# EAGLE design BUS2BUS_1 (EAGLE 6.5.0)
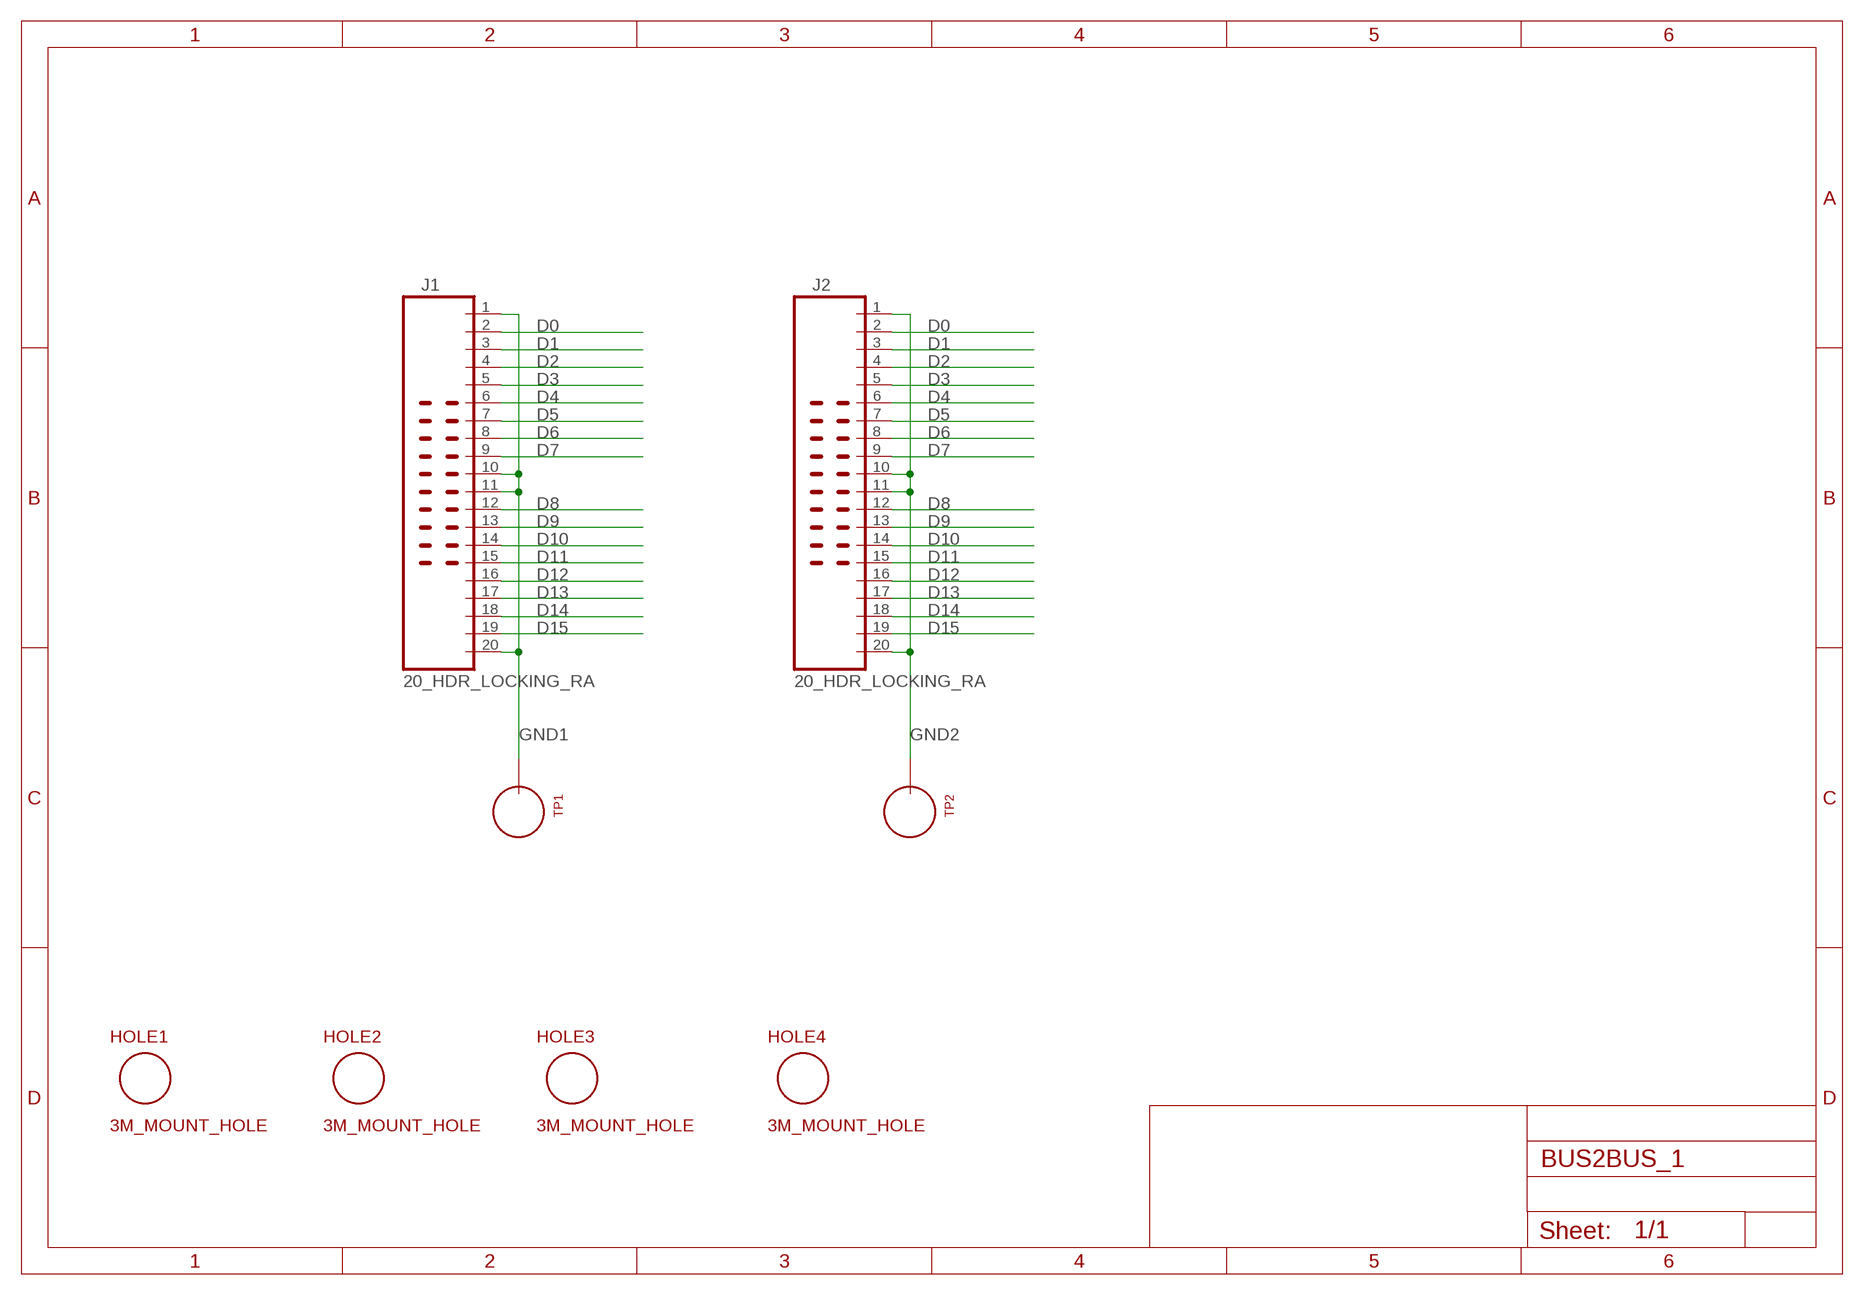
[diagram p0: schematic, sheet 1]

## Parts
HOLE1  3M_MOUNT_HOLE  [3M_HOLE]
HOLE2  3M_MOUNT_HOLE  [3M_HOLE]
HOLE3  3M_MOUNT_HOLE  [3M_HOLE]
HOLE4  3M_MOUNT_HOLE  [3M_HOLE]
J1  20_HDR_LOCKING_RA  [20_HDR_LOCKING_RA]
J2  20_HDR_LOCKING_RA  [20_HDR_LOCKING_RA]
TP1  TEST_LOOP  [TEST_LOOP]
TP2  TEST_LOOP  [TEST_LOOP]

## Nets
D0: J1.2 J2.2
D1: J1.3 J2.3
D2: J1.4 J2.4
D3: J1.5 J2.5
D4: J1.6 J2.6
D5: J1.7 J2.7
D6: J1.8 J2.8
D7: J1.9 J2.9
D8: J1.12 J2.12
D9: J1.13 J2.13
D10: J1.14 J2.14
D11: J1.15 J2.15
D12: J1.16 J2.16
D13: J1.17 J2.17
D14: J1.18 J2.18
D15: J1.19 J2.19
GND1: J1.1 J1.10 J1.11 J1.20 TP1.P$1
GND2: J2.1 J2.10 J2.11 J2.20 TP2.P$1

## Library data of the parts
HOLE1-HOLE4 = MyLib:3M_MOUNT_HOLE
J1 J2 = MyLib:20_HDR_LOCKING_RA
TP1 TP2 = MyLib:TEST_LOOP

## Board
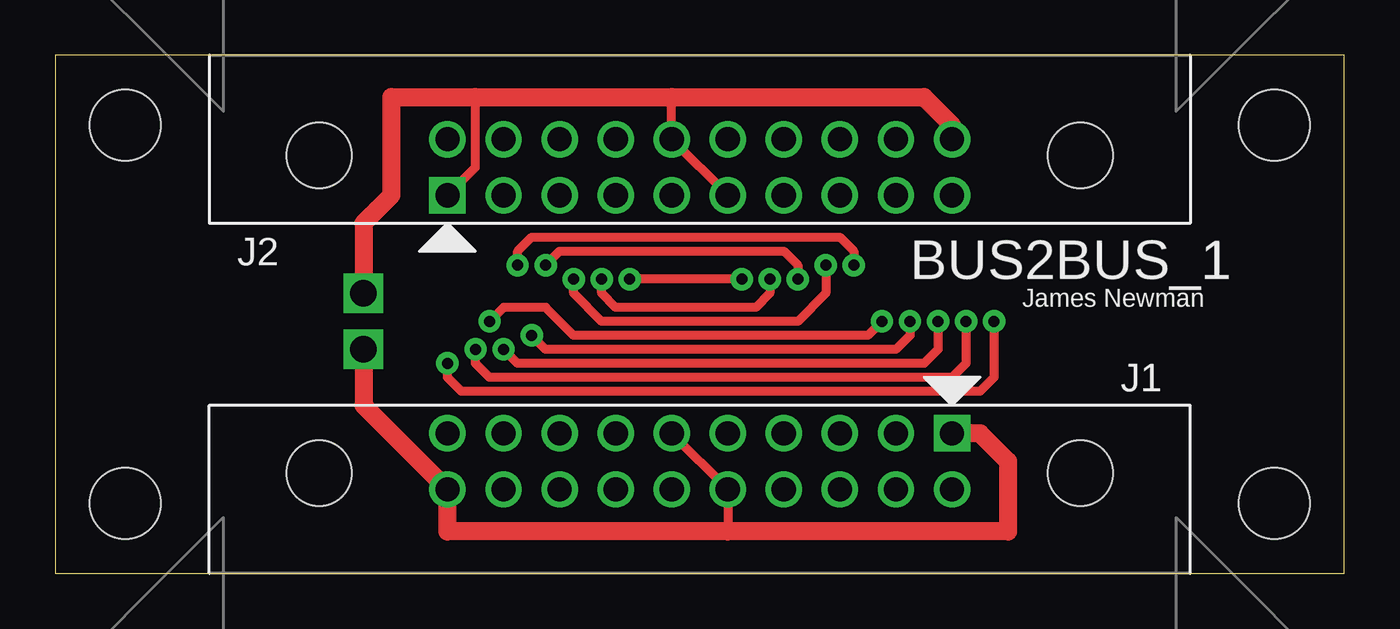
[diagram p1: board, top side]
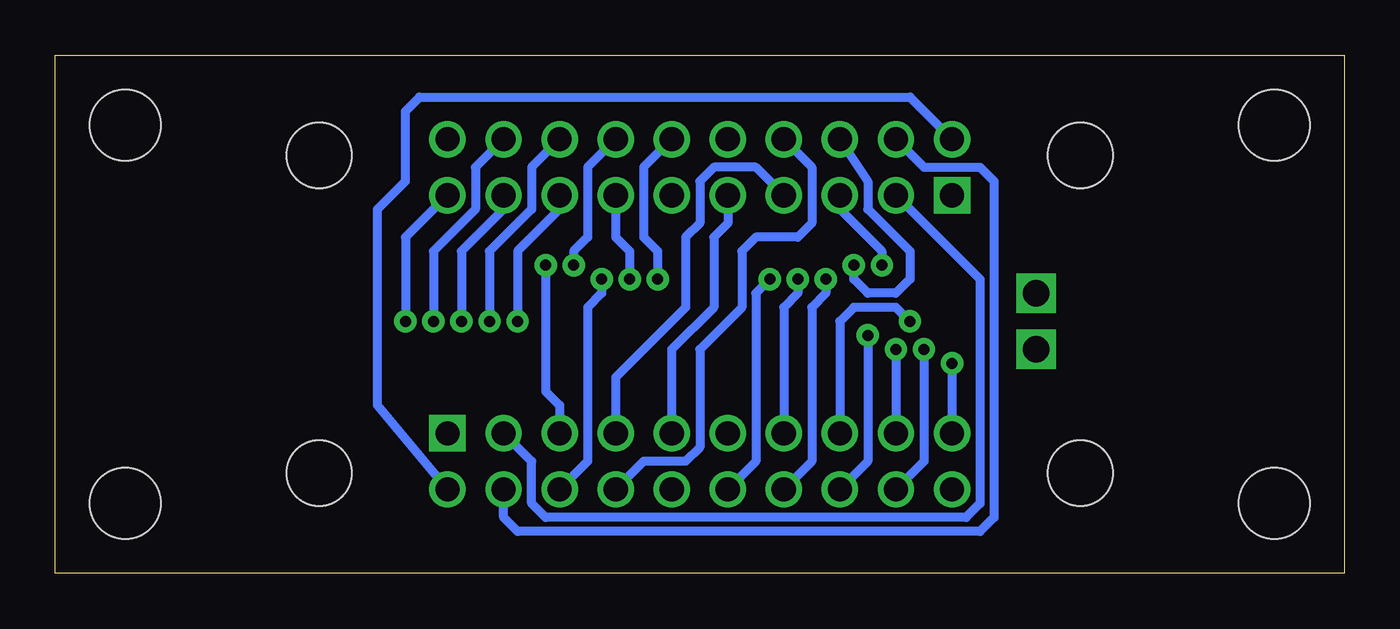
[diagram p2: board, bottom side, seen from below]

Size 58.42 x 23.5 mm. Coordinates in mm from the lower left corner, seen from the top.
Outline: 0,0 58.42,0 58.42,23.5 0,23.5 0,0
Copper layers (1*16): Top 0.035mm / dielectric 1.5mm / Bottom 0.035mm
Design rules "processor_rules_2layer": minimum track width 8mil, minimum drill 14mil, track to track 8mil, track to pad 8mil, pad to pad 8mil, via to via 8mil, smd to smd 8mil, copper to edge 40mil, drill to drill 8mil, minimum pad ring 10mil, minimum via ring 8mil, stop-mask expansion 4mil, vias tented up to drill 0mil, thermal gap 10mil

### Footprints (pad centres in the part's own frame; a part is rotated, then mirrored left to right if it is on the bottom)
3M_HOLE = hole 3.2: 0,0
20_HDR_LOCKING_RA = drill 1.1 square: 1 -11.43,-1.27 | drill 1.1: 2 -11.43,1.27; 3 -8.89,-1.27; 4 -8.89,1.27; 5 -6.35,-1.27; 6 -6.35,1.27; 7 -3.81,-1.27; 8 -3.81,1.27; 9 -1.27,-1.27; 10 -1.27,1.27; 11 1.27,-1.27; 12 1.27,1.27; 13 3.81,-1.27; 14 3.81,1.27; 15 6.35,-1.27; 16 6.35,1.27; 17 8.89,-1.27; 18 8.89,1.27; 19 11.43,-1.27; 20 11.43,1.27 | hole 2.946: -17.247,0.533; 17.247,0.533
TEST_LOOP = drill 1.2 square: P$1 0,0

### Placement (x,y rotation side)
HOLE1  3.17,3.17 0 top
HOLE2  55.24,3.17 0 top
HOLE3  3.17,20.32 0 top
HOLE4  55.24,20.32 0 top
J1  29.21,5.08 180 top
J2  29.21,18.41 0 top
TP1  13.97,10.16 0 top
TP2  13.97,12.7 0 top

### Tracks (layer width: path | path; a pad name or v marks a point on that pad's centre or on a via)
D0
  Bottom 0.406: J1.2 43.81,7.62 43.81,16.51 42.55,17.78 42.55,20.95 41.91,21.59 19.68,21.59 J2.2
D1
  Bottom 0.406: J2.3 16.51,13.34 16.51,3.17 17.14,2.54 36.2,2.54 36.83,3.17 36.83,5.08 J1.3
D2
  Bottom 0.406: J2.4 19.05,18.41 16.51,18.41 15.88,17.78 15.88,2.54 16.51,1.91 37.47,1.91 38.1,2.54 J1.4
D3  (via drill 0.5 pad 1.02)
  Top 0.406: v20.95,13.97 20.95,14.61 21.59,15.24 35.56,15.24 36.2,14.61 v36.2,13.97
  Bottom 0.406: J2.5 22.86,16.51 20.95,14.61 v20.95,13.97 | v36.2,13.97 36.2,8.26 35.56,7.62 J1.5
D4  (via drill 0.5 pad 1.02)
  Top 0.406: v22.23,13.97 22.86,14.61 33.02,14.61 33.66,13.97 v33.66,13.34
  Bottom 0.406: J2.6 21.59,17.78 21.59,16.51 19.68,14.61 19.68,13.34 20.32,12.7 21.59,12.7 22.23,13.34 v22.23,13.97 | v33.66,13.34 33.66,12.7 34.29,12.06 34.29,5.08 J1.6
D5
  Bottom 0.406: J2.7 26.67,18.41 28.57,18.41 29.21,17.78 29.21,15.88 29.84,15.24 29.84,12.06 33.02,8.89 J1.7
D6
  Bottom 0.406: J2.8 24.13,18.41 24.13,15.88 24.77,15.24 26.67,15.24 27.3,14.61 27.3,12.06 29.21,10.16 29.21,5.71 29.84,5.08 31.75,5.08 J1.8
D7
  Bottom 0.406: J2.9 27.94,15.88 28.57,15.24 28.57,12.06 30.48,10.16 J1.9
D8  (via drill 0.5 pad 1.02)
  Top 0.406: v31.11,13.34 v26.04,13.34
  Bottom 0.406: J2.12 31.75,18.41 31.75,15.24 31.11,14.61 v31.11,13.34 | v26.04,13.34 26.67,12.7 26.67,5.08 J1.12
D9  (via drill 0.5 pad 1.02)
  Top 0.406: v32.38,13.34 32.38,12.7 31.75,12.06 25.4,12.06 24.77,12.7 v24.77,13.34
  Bottom 0.406: J2.13 33.02,15.24 32.38,14.61 v32.38,13.34 | v24.77,13.34 24.77,12.7 25.4,12.06 J1.13
D10  (via drill 0.5 pad 1.02)
  Top 0.406: v34.92,13.97 34.92,12.7 33.66,11.43 24.77,11.43 23.5,12.7 v23.5,13.34
  Bottom 0.406: J2.14 34.29,18.41 34.29,15.24 34.92,14.61 v34.92,13.97 | v23.5,13.34 23.5,12.7 24.13,12.06 24.13,5.08 J1.14
D11  (via drill 0.5 pad 1.02)
  Top 0.406: v37.47,11.43 36.83,10.79 23.5,10.79 22.23,12.06 20.32,12.06 v19.68,11.43
  Bottom 0.406: J2.15 35.56,16.51 37.47,14.61 v37.47,11.43 | v19.68,11.43 20.32,12.06 22.23,12.06 22.86,11.43 J1.15
D12  (via drill 0.5 pad 1.02)
  Top 0.406: v38.73,11.43 38.73,10.79 38.1,10.16 22.23,10.16 v21.59,10.79
  Bottom 0.406: J2.16 36.83,18.41 36.83,16.51 38.73,14.61 v38.73,11.43 | v21.59,10.79 21.59,5.08 J1.16
D13  (via drill 0.5 pad 1.02)
  Top 0.406: v40.01,11.43 40.01,10.16 39.37,9.53 20.95,9.53 v20.32,10.16
  Bottom 0.406: J2.17 38.1,16.51 40.01,14.61 v40.01,11.43 | v20.32,10.16 J1.17
D14  (via drill 0.5 pad 1.02)
  Top 0.406: v41.27,11.43 41.27,9.53 40.64,8.89 19.68,8.89 19.05,9.53 v19.05,10.16
  Bottom 0.406: J2.18 39.37,18.41 39.37,16.51 41.27,14.61 v41.27,11.43 | v19.05,10.16 19.05,5.08 J1.18
D15  (via drill 0.5 pad 1.02)
  Top 0.406: v42.55,11.43 42.55,8.89 41.91,8.26 18.41,8.26 17.78,8.89 v17.78,9.53
  Bottom 0.406: J2.19 42.55,15.24 v42.55,11.43 | v17.78,9.53 J1.19
GND1
  Top 0.406: 30.48,1.91 J1.10 J1.11
  Top 0.813: J1.1 41.91,6.35 43.18,5.08 43.18,1.91 30.48,1.91 17.78,1.91 J1.20 13.97,7.62 TP1.P$1
GND2
  Top 0.406: J2.11 J2.10 27.94,21.59 | J2.1 19.05,18.41 19.05,21.59
  Top 0.813: J2.20 40.64,20.32 39.37,21.59 27.94,21.59 19.05,21.59 15.24,21.59 15.24,17.14 13.97,15.88 TP2.P$1

### Text on the board
tPlace: BUS2BUS_1 | James Newman